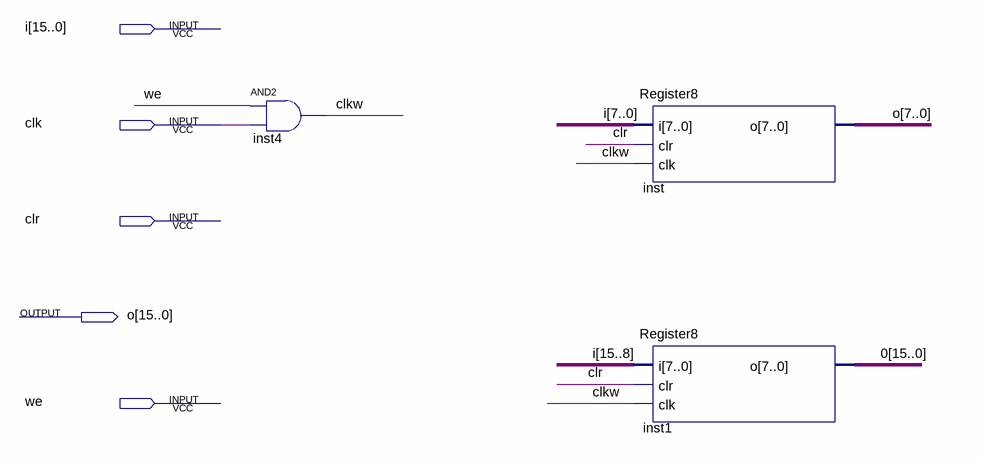
[diagram p0: schematic sheet]
// Quartus schematic Register_16.bdf as structural Verilog: 3 symbols, 5 pins
module Register_16 (
  input  [15:0] i,
  input  clk,
  input  clr,
  input  we,
  output [15:0] o
);

  wire clkw;
  wire [15:0] \0 ;

  and inst4 (clkw, we, clk);
  Register8 inst (.i(i[7:0]), .clr(clr), .clk(clkw), .o(o[7:0]));
  Register8 inst1 (.i(i[15:8]), .clr(clr), .clk(clkw), .o(\0 ));
endmodule
